# Altium schematic sheet [02] - Power_Supplies.SchDoc
size A4
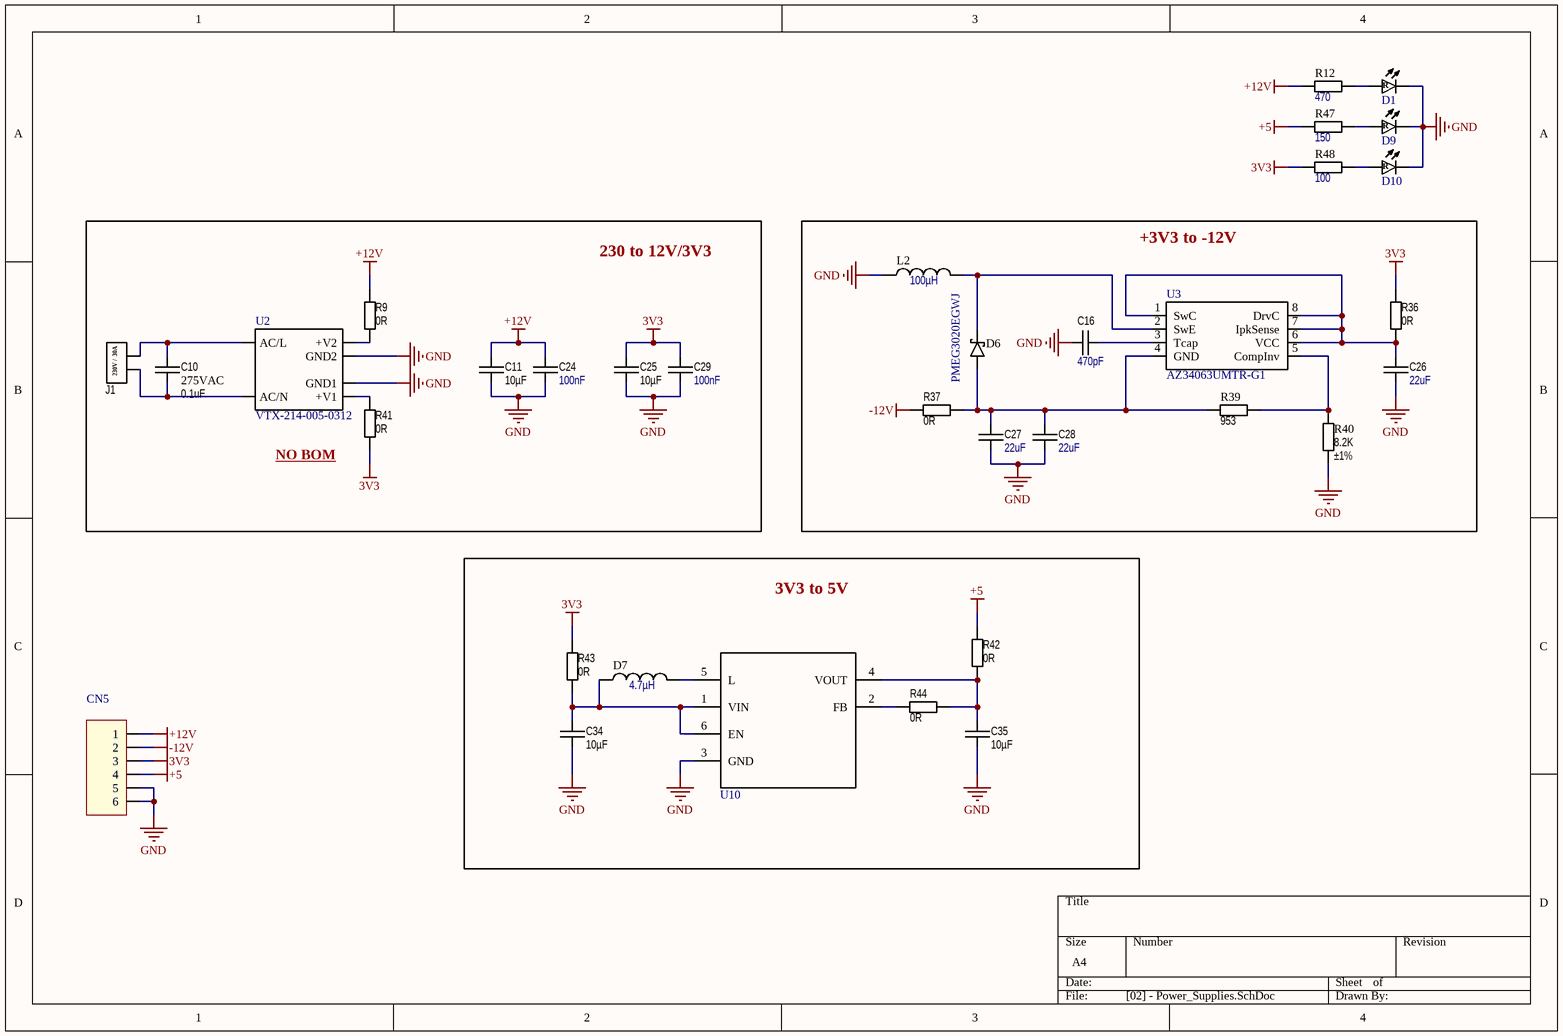
[diagram p0: [02] - Power_Supplies.SchDoc]

## Parts
C10  value 0.1uF  Voltage: 275VAC  [ECQL]  (hidden comment: ECQ-U2A104ML)
C11  value 10µF  [CAP 0603/1608]  (hidden comment: GRM188R61E106MA73D)
C16  value 470pF  [CAP 0603/1608]  (hidden comment: CAP CER 470PF 50V X7R 0603)
C24  value 100nF  [CAP 0603/1608]  (hidden comment: CAP CER 1UF 16V X5R 0603)
C25  value 10µF  [CAP 0603/1608]  (hidden comment: GRM188R61E106MA73D)
C26  value 22uF  [CAP 0603/1608]  (hidden comment: CAP CER 22UF 6.3V X5R 0603)
C27  value 22uF  [CAP 0603/1608]  (hidden comment: CAP CER 22UF 6.3V X5R 0603)
C28  value 22uF  [CAP 0603/1608]  (hidden comment: CAP CER 22UF 6.3V X5R 0603)
C29  value 100nF  [CAP 0603/1608]  (hidden comment: CAP CER 1UF 16V X5R 0603)
C34  value 10µF  [CAP 0603/1608]  (hidden comment: GRM188R61E106MA73D)
C35  value 10µF  [CAP 0603/1608]  (hidden comment: GRM188R61E106MA73D)
CN5  61300411121  [Terminal_6]  (value not drawn)  (no BOM)
D1  SML-D12U1WT86  [LED-0603]  (value not drawn)
D6  PMEG3020EGWJ  [SOD123]
D7  value 4.7µH  [IND_LQH2HPN4R7MJRL]  (hidden comment: LQH2HPN4R7MJRL)
D9  SML-D12U1WT86  [LED-0603]  (value not drawn)
D10  SML-D12U1WT86  [LED-0603]  (value not drawn)
J1  1868076  [30Amp_Connector]  (value not drawn)
L2  value 100µH  [IND_1210]  (hidden comment: FIXED IND 100UH 150MA 1.4 OHM)
R9  value 0R  [R0603]  (hidden comment: RES 0R 0603 JUMPER)
R12  value 470  [R0603]  (hidden comment: RES SMD 470 OHM 1% 1/10W 0603)
R36  value 0R  [R0603]  (hidden comment: RES 0R 0603 JUMPER)
R37  value 0R  [R0603]  (hidden comment: RES 0R 0603 JUMPER)
R39  value 953  [R0603]  (hidden comment: RC0603FR-07953RL)
R40  value 8.2K  Tolerance: ±1%  [R0603]  (hidden comment: RES SMD 8.2K OHM 1% 1/8W 0603)
R41  value 0R  [R0603]  (hidden comment: RES 0R 0603 JUMPER)
R42  value 0R  [R0603]  (hidden comment: RES 0R 0603 JUMPER)
R43  value 0R  [R0603]  (hidden comment: RES 0R 0603 JUMPER)
R44  value 0R  [R0603]  (hidden comment: RES 0R 0603 JUMPER)
R47  value 150  [R0603]  (hidden comment: RES SMD 150 OHM 5% 1/10W 0603)
R48  value 100  [R0603]  (hidden comment: RES SMD 100 OHM 1% 1/10W 0603)
U2  VTX-214-005-0312  [AC-DC_VTX]  (no BOM)
U3  AZ34063UMTR-G1  [SOIC-8]
U10  TPS61222DCKR  [SC-70-6]  (value not drawn)

## Blocks framed on the sheet
230 to 12V/3V3: C10 C11 C24 C25 C29 J1 R9 R41 U2
+3V3 to -12V: C16 C26-C28 D6 L2 R36 R37 R39 R40 U3
3V3 to 5V: C34 C35 D7 R42-R44 U10

## Nets
3V3: C25.1 C29.1 CN5.3 R36.2 R41.1 R43.1 R48.1
+5: CN5.4 R42.1 R47.1
+12V: C11.1 C24.1 CN5.1 R9.2 R12.1
-12V: CN5.2 R37.1
GND: C11.2 C16.1 C24.2 C25.2 C26.1 C27.1 C28.1 C29.2 C34.2 C35.2 CN5.5 CN5.6 D1.1 D9.1 D10.1 L2.1 R40.2 U2.3(GND1) U2.5(GND2) U10.3(GND)
NetC10_1: C10.1 J1.1 U2.2(AC/N)
NetC10_2: C10.2 J1.2 U2.1(AC/L)
NetC16_2: C16.2 U3.3(Tcap)
NetC26_2: C26.2 R36.1 U3.1(SwC) U3.6(VCC) U3.7(IpkSense) U3.8(DrvC)
NetC27_2: C27.2 C28.2 D6.A R37.2 R39.1 U3.4(GND)
NetC34_1: C34.1 D7.1 R43.2 U10.1(VIN) U10.6(EN)
NetC35_1: C35.1 R42.2 R44.2 U10.4(VOUT)
NetD1_2: D1.2 R12.2
NetD6_C: D6.C L2.2 U3.2(SwE)
NetD7_2: D7.2 U10.5(L)
NetD9_2: D9.2 R47.2
NetD10_2: D10.2 R48.2
NetR9_1: R9.1 U2.6(+V2)
NetR39_2: R39.2 R40.1 U3.5(CompInv)
NetR41_2: R41.2 U2.4(+V1)
NetR44_1: R44.1 U10.2(FB)

## Notes on the sheet
- NO BOM
- (in symbol LED_RED) R
- (in symbol TERM_BLK_02_30A) 230V /  30A

## Library data of the parts
C10 = CAPC_0.1uF_RADIAL_275VAC: 0.1µF Film Capacitor 275V  Polyester, Metallized Radial; Manufacturer: Panasonic Electronic Components; Type: TH; Tolerance: ±20%; Package: Radial; PartNumber: ECQ-U2A104ML; Price1: 0.39000; Price1000: 0.10165; Link: https://www.digikey.com/product-detail/en/panasonic-electronic-components/ECQ-U2A104ML/P10730-ND/281393; Price100: 0.16050; Price10: 0.26800
C11 C25 C34 C35 = CAPC_10uF_0603_25V: 10µF ±20% 25V Ceramic Capacitor X5R 0603 (1608 Metric); Manufacturer: Murata Electronics; Type: SMD; Package: 0603; PartNumber: GRM188R61E106MA73D; Price1: 0.42000; Price1000: 0.11123; Link: https://www.digikey.com/product-detail/en/murata-electronics/GRM188R61E106MA73D/490-7202-1-ND/3900486; Tolerance: ±20%; Price100: 0.17560; Voltage: 25V; Price10: 0.29300
C16 = CAPC_470pF_0603_50V: 470pF ±10% 50V Ceramic Capacitor X7R 0603 (1608 Metric); PartNumber: CC0603KRX7R9BB471; Manufacturer: Yageo; Type: SMD; Package: 0603 (1608 Metric); Price1: 0.10000; Price1000: 0.01188; Link: https://www.digikey.com/product-detail/en/yageo/CC0603KRX7R9BB471/311-1078-1-ND/302988; Tolerance: ±10%; Price100: 0.02120; Voltage: 50V; Price10: 0.04800
C24 C29 = CAPC_100NF_0603_50V: 1µF ±10% 16V Ceramic Capacitor X5R 0603 (1608 Metric) /; PartNumber: CC0603KRX5R7BB105; Manufacturer: Yageo; Type: SMD; Package: 0603 (1608 Metric); Price1: 0.11000; Price1000: 0.02217; Link: https://www.digikey.com/product-detail/en/yageo/CC0603KRX5R7BB105/311-1444-1-ND/2833750; Tolerance: ±10%; Price100: 0.03820; Voltage: 16V; Price10: 0.08100
C26-C28 = CAPC_22uF_0603_6.3V: 22µF ±20% 6.3V Ceramic Capacitor X5R 0603 (1608 Metric); PartNumber: GRM188R60J226MEA0D; Manufacturer: Murata Electronics; Type: SMD; Package: 0603; Price1: 0.26000; Price1000: 0.06176; Link: https://www.digikey.com/product-detail/en/murata-electronics/GRM188R60J226MEA0D/490-7611-1-ND/4280544; Tolerance: ±20%; Price100: 0.10000; Voltage: 6.3V; Price10: 0.17600
CN5 = CONN_6POS: Connector Header Through Hole 4 position 0.100" (2.54mm); Manufacturer: Wurth Electronics Inc.; Availablity: Available; Alternative: *; Package: 0.100" (2.54mm); Type: THT; Link: https://www.digikey.com/product-detail/en/wurth-electronics-inc/61300411121/732-5317-ND/4846827; PartNumber: 61300411121; Footprint: =Footprint; Price1: 0.18000; Price10: 0.15300; Price100: 0.09600; Price1000: 0.08800; Value: *
D1 D9 D10 = LED_RED: Red 620nm LED Indication - Discrete 2.2V 0603 (1608 Metric); Manufacturer: Rohm Semiconductor; Type: SMD; Alternative: *; Footprint: =Footprint; Link: https://www.digikey.com/product-detail/en/rohm-semiconductor/SML-D12U1WT86/SML-D12U1WT86CT-ND/5843858; Package: 0603 (1608 Metric); PartNumber: SML-D12U1WT86; Availability: Available; Price1: 0.21000; Price10: 0.15500; Price100: 0.07330; Price1000: 0.03826; Value: *
D6 = DIODE_PMEG: Diode Schottky 30V 2A Surface Mount SOD-123; Manufacturer: Nexperia USA Inc.; Type: SMD; Value: 30V 2A; Package: SOD-123; PartNumber: PMEG3020EGWJ; Link: https://www.digikey.com/product-detail/en/nexperia-usa-inc/PMEG3020EGWJ/1727-7332-1-ND/7390583; Price1: 0.39000; Price1000: 0.08269; Alternative: *; Footprint: =Footprint; Price10: 0.28800; Price100: 0.13660; Availability: Available
D7 = IND_4.7uH_170mOhm _Murata: 4.7µH Shielded Wirewound Inductor 770mA 204mOhm Max 1008 (2520 Metric); Manufacturer: Murata Electronics; Type: SMD; Package: 1008 (2520 Metric); PartNumber: LQH2HPN4R7MJRL; Link: https://www.digikey.com/product-detail/en/murata-electronics/LQH2HPN4R7MJRL/490-9904-2-ND/5018243; Price1: 0.17046; Price1000: 0.15152; Alternative: *; Footprint: =Footprint; Price10: 0.15152; Price100: 0.15152; Availability: Available
J1 = TERM_BLK_02_30A: 2 Position Wire to Board Terminal Block Horizontal with Board 0.300" (7.62mm) Through Hole; Manufacturer: Phoenix Contact; Type: TH; PartNumber: 1868076; Link: https://www.digikey.com/product-detail/en/phoenix-contact/1868076/277-5840-ND/2511066; Price1: 1.71000; Price100: 1.42740; Footprint: =Footprint; Price10: 1.66000; Price1000: 1.17914
L2 = IND_100uH: 100µH Unshielded Wirewound Inductor 150mA 1.4Ohm 1210 (3225 Metric); PartNumber: LBC3225T101KR; Manufacturer: Taiyo Yuden; Type: SMD; Package: 1210 (3225 Metric); Link: https://www.digikey.com/product-detail/en/taiyo-yuden/LBC3225T101KR/587-2422-1-ND/2230288; Price1: 0.21000; Price1000: 0.10350; Alternative: *; Footprint: =Footprint; Price10: 0.18600; Price100: 0.12420; Availability: Available
R9 R36 R37 R41-R44 = RES_0R_0603_JUMPER: PartNumber: RC0603JR-070RL; Manufacturer: Yageo; Type: SMT; Package: 0603; Link: https://www.digikey.com/product-detail/en/yageo/RC0603JR-070RL/311-0.0GRTR-ND/726675; Price1: 0.1; Price1000: 0.00396; Price10: 0.022; Price100: 0.0088
R12 = RES_470_0603_1%_1: 470 Ohms ±1% 0.1W, 1/10W Chip Resistor 0603 (1608 Metric) Moisture Resistant Thick Film; PartNumber: RC0603FR-07470RL; Manufacturer: Yageo; Type: SMD; Package: 0603; Link: https://www.digikey.com/product-detail/en/yageo/RC0603FR-07470RL/311-470HRCT-ND/730203; Price1: 0.10000; Price1000: 0.00421; Price100: 0.00940; Price10: 0.02300; Tolerance: ±1%
R39 = RES_953: 953 Ohms ±1% 0.1W, 1/10W Chip Resistor 0603 (1608 Metric) Moisture Resistant Thick Film; Manufacturer: Yageo; Type: SMD; Package: 0603 (1608 Metric); PartNumber: RC0603FR-07953RL; Link: https://www.digikey.com/product-detail/en/yageo/RC0603FR-07953RL/311-953HRCT-ND/730384; Price1: 0.10000; Price1000: 0.00421; Alternative: *; Footprint: =Footprint; Price10: 0.02300; Price100: 0.02300; Availability: Available
R40 = RES_8K2_0603_1%: 8.2 kOhms ±1% 0.125W, 1/8W Chip Resistor 0603 (1608 Metric) Anti-Sulfur Thin Film; PartNumber: MCT06030C8201FP500; Manufacturer: Vishay Beyschlag; Type: SMD; Package: 0603 (1608 Metric); Link: https://www.digikey.com/product-detail/en/yageo/RC0603JR-074K7L/311-4.7KGRTR-ND/726785; Price1: 0.17000; Price1000: 0.02376; Price100: 0.05680; Price10: 0.14500
R47 = RES_150_0603_5%: 150 Ohms ±5% 0.1W, 1/10W Chip Resistor 0603 (1608 Metric) Moisture Resistant Thick Film; PartNumber: RC0603JR-07150RL; Manufacturer: Yageo; Type: SMD; Package: 0603; Link: https://www.digikey.com/product-detail/en/yageo/RC0603JR-07150RL/311-150GRCT-ND/729661; Price1: 0.10000; Price1000: 0.00347; Tolerance: ±5%; Price10: 0.01900; Price100: 0.00770
R48 = RES_100_0603_1%: 100 Ohms ±1% 0.1W, 1/10W Chip Resistor 0603 (1608 Metric) Moisture Resistant Thick Film; PartNumber: RC0603FR-07100RL; Manufacturer: Yageo; Type: SMD; Package: 0603; Link: https://www.digikey.com/product-detail/en/yageo/RC0603FR-07100RL/311-100HRCT-ND/729835; Price1: 0.10000; Price1000: 0.00421; Price100: 0.00940; Price10: 0.02300; Tolerance: ±1%
U2 = AC/DC-VTX: VTX-214-005-0312 -  AC / DC PCB Mount Power Supply (PSU), ITE, 2 Output, 5W, 3.3V, 757mA, 12V; Manufacturer: VIGORTRONIX; Alternative: *; Footprint: =Footprint; Link: https://lt.farnell.com/vigortronix/vtx-214-005-0312/power-supply-ac-dc-3-3v-0-757a/dp/2627172; PartNumber: VTX-214-005-0312; Type: TH; Price1: 14.22; Price10: 9.08; Price100: 7.89; Price1000: 7.89; Value: *
U3 = IC_REG: Buck, Boost Switching Regulator IC Positive or Negative Adjustable 1.25V 1 Output 1.5A (Switch) 8-SOIC (0.154", 3.90mm Width); Manufacturer: Diodes Incorporated; Footprint: =Footprint; Link: https://www.digikey.com/product-detail/en/diodes-incorporated/AZ34063UMTR-G1/AZ34063UMTR-G1DICT-ND/4505211; Package: 8-SOIC; PartNumber: AZ34063UMTR-G1; Price1: 0.48000; Price10: 0.38700; Price100: 0.23890; Price1000: 0.13591; Type: TH; Value: *
U10 = IC_REG_BOOST: Boost Switching Regulator IC Positive Fixed 5V 1 Output 200mA (Switch) 6-TSSOP, SC-88, SOT-363; Manufacturer: Texas Instruments; Alternative: *; Package: SC-70; Price1000: 0.48163; PartNumber: TPS61222DCKR; Price1: 1.14000; Value: *; Price10: 1.01500; Type: SMD; Price100: 0.73960; Footprint: =footprintt; Link: https://www.digikey.com/product-detail/en/texas-instruments/TPS61222DCKR/296-39435-1-ND/5143383